# Altium schematic sheet obc-v2_OUT-eMMC.SchDoc
size 420 x 297 mm; SheetNumber: 5; SheetTotal: 23
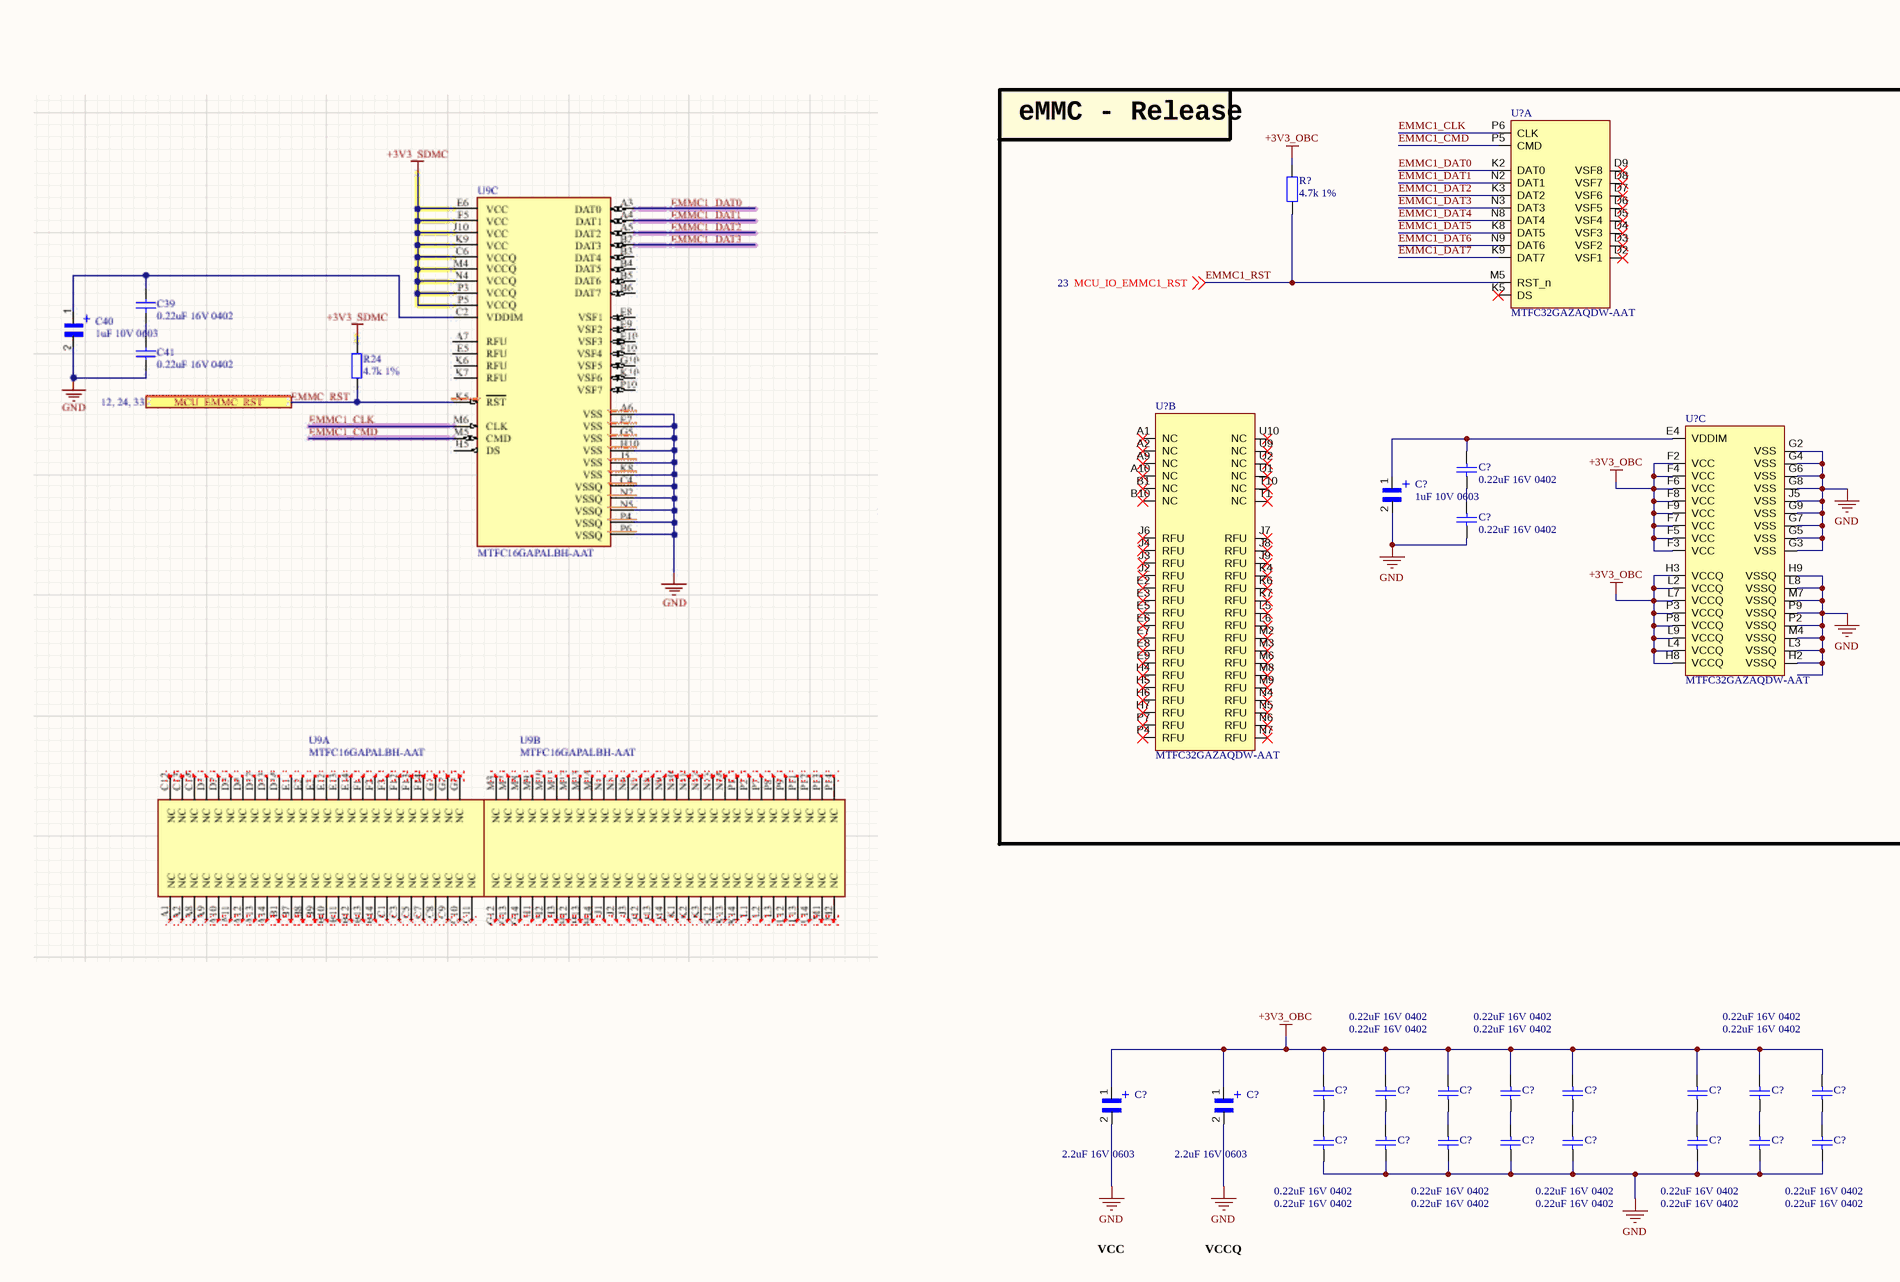
[diagram p0: obc-v2_OUT-eMMC.SchDoc, left]
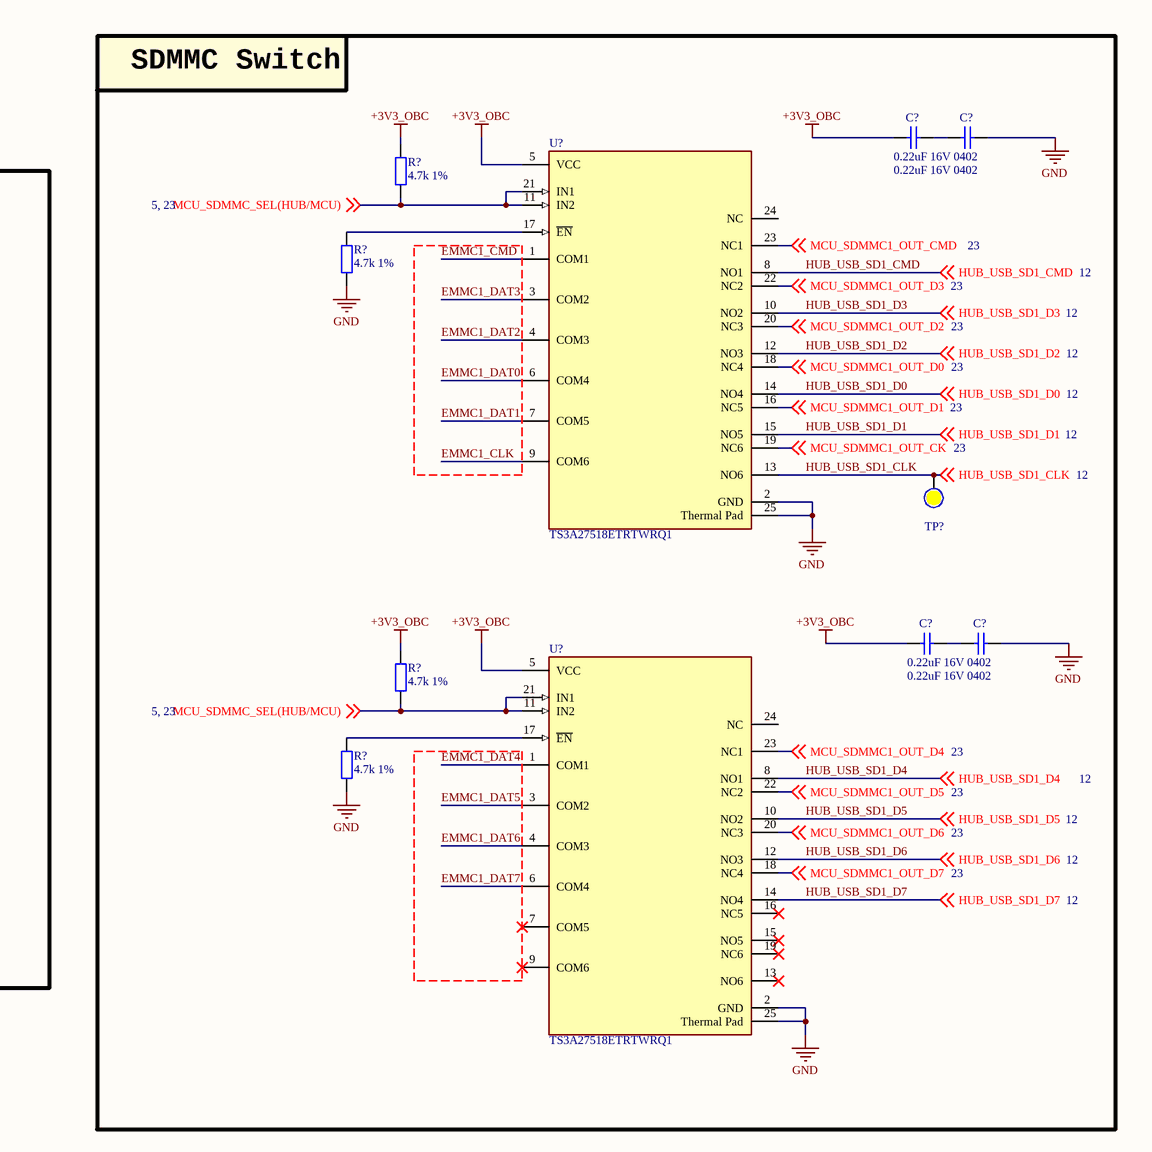
[diagram p1: obc-v2_OUT-eMMC.SchDoc, right]

## Parts
(Parts that share a designator on the sheet are numbered #1, #2 ... from top to bottom, then left to right.)
C?#1  0.22uF 16V 0402  [tu 0402]
C?#2  0.22uF 16V 0402  [tu 0402]
C?#3  0.22uF 16V 0402  [tu 0402]
C?#4  1uF 10V 0603  [CAPC1608X90]
C?#5  0.22uF 16V 0402  [tu 0402]
C?#6  0.22uF 16V 0402  [tu 0402]
C?#7  0.22uF 16V 0402  [tu 0402]
C?#8  0.22uF 16V 0402  [tu 0402]
C?#9  0.22uF 16V 0402  [tu 0402]
C?#10  0.22uF 16V 0402  [tu 0402]
C?#11  0.22uF 16V 0402  [tu 0402]
C?#12  0.22uF 16V 0402  [tu 0402]
C?#13  0.22uF 16V 0402  [tu 0402]
C?#14  0.22uF 16V 0402  [tu 0402]
C?#15  0.22uF 16V 0402  [tu 0402]
C?#16  2.2uF 16V 0603  [CAPC1608X90]
C?#17  2.2uF 16V 0603  [CAPC1608X90]
C?#18  0.22uF 16V 0402  [tu 0402]
C?#19  0.22uF 16V 0402  [tu 0402]
C?#20  0.22uF 16V 0402  [tu 0402]
C?#21  0.22uF 16V 0402  [tu 0402]
C?#22  0.22uF 16V 0402  [tu 0402]
C?#23  0.22uF 16V 0402  [tu 0402]
C?#24  0.22uF 16V 0402  [tu 0402]
C?#25  0.22uF 16V 0402  [tu 0402]
R?#1  4.7k 1%  [tro smd 0603]
R?#2  4.7k 1%  [tro smd 0603]
R?#3  4.7k 1%  [tro smd 0603]
R?#4  4.7k 1%  [tro smd 0603]
R?#5  4.7k 1%  [tro smd 0603]
TP?  (no value)  [Test Point 1 Side]  (no BOM)
U?#1  TS3A27518ETRTWRQ1  [FP-RTW0024B-IPC_A]
U?#2  MTFC32GAZAQDW-AAT  (part A of 3)
U?#3  MTFC32GAZAQDW-AAT  (part C of 3)
U?#4  TS3A27518ETRTWRQ1  [FP-RTW0024B-IPC_A]
U?#5  MTFC32GAZAQDW-AAT  (part B of 3)

## Blocks framed on the sheet
SDMMC Switch: C?#1 C?#2 C?#6 C?#7 R?#1 R?#2 R?#4 R?#5 TP? U?#1 U?#4
eMMC - Release: C?#3-C?#5 R?#3 U?#2 U?#3 U?#5

## Nets
+3V3_OBC: C?#1.2 C?#6.2 C?#8.1 C?#9.1 C?#10.1 C?#11.1 C?#12.1 C?#13.1 C?#14.1 C?#15.1 C?#16.1 C?#17.1 R?#1.1 R?#3.1 R?#4.1 U?#1.5(VCC) U?#3.F2(VCC) U?#3.F3(VCC) U?#3.F4(VCC) U?#3.F5(VCC) U?#3.F6(VCC) U?#3.F7(VCC) U?#3.F8(VCC) U?#3.F9(VCC) U?#3.H3(VCCQ) U?#3.H8(VCCQ) U?#3.L2(VCCQ) U?#3.L4(VCCQ) U?#3.L7(VCCQ) U?#3.L9(VCCQ) U?#3.P3(VCCQ) U?#3.P8(VCCQ) U?#4.5(VCC)
GND: C?#2.1 C?#4.2 C?#5.2 C?#7.1 C?#16.2 C?#17.2 C?#18.2 C?#19.2 C?#20.2 C?#21.2 C?#22.2 C?#23.2 C?#24.2 C?#25.2 R?#2.2 R?#5.2 U?#1.2(GND) U?#1.25(Thermal_Pad) U?#3.G2(VSS) U?#3.G3(VSS) U?#3.G4(VSS) U?#3.G5(VSS) U?#3.G6(VSS) U?#3.G7(VSS) U?#3.G8(VSS) U?#3.G9(VSS) U?#3.H2(VSSQ) U?#3.H9(VSSQ) U?#3.J5(VSS) U?#3.L3(VSSQ) U?#3.L8(VSSQ) U?#3.M4(VSSQ) U?#3.M7(VSSQ) U?#3.P2(VSSQ) U?#3.P9(VSSQ) U?#4.2(GND) U?#4.25(Thermal_Pad)
EMMC1_CLK: U?#1.9(COM6) U?#2.P6(CLK)
EMMC1_CMD: U?#1.1(COM1) U?#2.P5(CMD)
EMMC1_DAT0: U?#1.6(COM4) U?#2.K2(DAT0)
EMMC1_DAT1: U?#1.7(COM5) U?#2.N2(DAT1)
EMMC1_DAT2: U?#1.4(COM3) U?#2.K3(DAT2)
EMMC1_DAT3: U?#1.3(COM2) U?#2.N3(DAT3)
EMMC1_DAT4: U?#2.N8(DAT4) U?#4.1(COM1)
EMMC1_DAT5: U?#2.K8(DAT5) U?#4.3(COM2)
EMMC1_DAT6: U?#2.N9(DAT6) U?#4.4(COM3)
EMMC1_DAT7: U?#2.K9(DAT7) U?#4.6(COM4)
EMMC1_RST: R?#3.2 U?#2.M5(RST_n) ; off-sheet MCU_IO_EMMC1_RST  [also labelled MCU_IO_EMMC1_RST]
HUB_USB_SD1_CLK: TP?.0 U?#1.13(NO6) ; off-sheet HUB_USB_SD1_CLK
HUB_USB_SD1_CMD: U?#1.8(NO1) ; off-sheet HUB_USB_SD1_CMD
HUB_USB_SD1_D0: U?#1.14(NO4) ; off-sheet HUB_USB_SD1_D0
HUB_USB_SD1_D1: U?#1.15(NO5) ; off-sheet HUB_USB_SD1_D1
HUB_USB_SD1_D2: U?#1.12(NO3) ; off-sheet HUB_USB_SD1_D2
HUB_USB_SD1_D3: U?#1.10(NO2) ; off-sheet HUB_USB_SD1_D3
HUB_USB_SD1_D4: U?#4.8(NO1) ; off-sheet HUB_USB_SD1_D4
HUB_USB_SD1_D5: U?#4.10(NO2) ; off-sheet HUB_USB_SD1_D5
HUB_USB_SD1_D6: U?#4.12(NO3) ; off-sheet HUB_USB_SD1_D6
HUB_USB_SD1_D7: U?#4.14(NO4) ; off-sheet HUB_USB_SD1_D7
MCU_SDMMC1_OUT_CK: U?#1.19(NC6) ; off-sheet MCU_SDMMC1_OUT_CK
MCU_SDMMC1_OUT_CMD: U?#1.23(NC1) ; off-sheet MCU_SDMMC1_OUT_CMD
MCU_SDMMC1_OUT_D0: U?#1.18(NC4) ; off-sheet MCU_SDMMC1_OUT_D0
MCU_SDMMC1_OUT_D1: U?#1.16(NC5) ; off-sheet MCU_SDMMC1_OUT_D1
MCU_SDMMC1_OUT_D2: U?#1.20(NC3) ; off-sheet MCU_SDMMC1_OUT_D2
MCU_SDMMC1_OUT_D3: U?#1.22(NC2) ; off-sheet MCU_SDMMC1_OUT_D3
MCU_SDMMC1_OUT_D4: U?#4.23(NC1) ; off-sheet MCU_SDMMC1_OUT_D4
MCU_SDMMC1_OUT_D5: U?#4.22(NC2) ; off-sheet MCU_SDMMC1_OUT_D5
MCU_SDMMC1_OUT_D6: U?#4.20(NC3) ; off-sheet MCU_SDMMC1_OUT_D6
MCU_SDMMC1_OUT_D7: U?#4.18(NC4) ; off-sheet MCU_SDMMC1_OUT_D7
MCU_SDMMC_SEL(HUB/MCU): R?#1.2 R?#4.2 U?#1.11(IN2) U?#1.21(IN1) U?#4.11(IN2) U?#4.21(IN1) ; off-sheet MCU_SDMMC_SEL(HUB/MCU)
NetC?#1_1: C?#1.1 C?#2.2
NetC?#3_1: C?#3.1 C?#4.1 U?#3.E4(VDDIM)
NetC?#3_2: C?#3.2 C?#5.1
NetC?#6_1: C?#6.1 C?#7.2
NetC?#8_2: C?#8.2 C?#18.1
NetC?#9_2: C?#9.2 C?#19.1
NetC?#10_2: C?#10.2 C?#20.1
NetC?#11_2: C?#11.2 C?#21.1
NetC?#12_2: C?#12.2 C?#22.1
NetC?#13_2: C?#13.2 C?#23.1
NetC?#14_2: C?#14.2 C?#24.1
NetC?#15_2: C?#15.2 C?#25.1
NetR?#2_1: R?#2.1 U?#1.17(~{EN})
NetR?#5_1: R?#5.1 U?#4.17(~{EN})

Not connected (* = marked no-connect by the designer): U?#1 24(NC); U?#2 D2(VSF1)* D3(VSF2)* D4(VSF3)* D5(VSF4)* D6(VSF5)* D7(VSF6)* D8(VSF7)* D9(VSF8)* K5(DS)*; U?#4 7(COM5)* 9(COM6)* 13(NO6)* 15(NO5)* 16(NC5)* 19(NC6)* 24(NC); U?#5 A1(NC)* A2(NC)* A9(NC)* A10(NC)* B1(NC)* B10(NC)* E2(RFU)* E3(RFU)* E5(RFU)* E6(RFU)* E7(RFU)* E8(RFU)* E9(RFU)* H4(RFU)* H5(RFU)* H6(RFU)* H7(RFU)* J2(RFU)* J3(RFU)* J4(RFU)* J6(RFU)* J7(RFU)* J8(RFU)* J9(RFU)* K4(RFU)* K6(RFU)* K7(RFU)* L5(RFU)* L6(RFU)* M2(RFU)* M3(RFU)* M6(RFU)* M8(RFU)* M9(RFU)* N4(RFU)* N5(RFU)* N6(RFU)* N7(RFU)* P4(RFU)* P7(RFU)* T1(NC)* T10(NC)* U1(NC)* U2(NC)* U9(NC)* U10(NC)*

## Notes on the sheet
- VCC
- VCCQ
- Project:
- Sub-system:
- Design by:
- Sheet title:
- Sheet
- A3
- of
- Checked by:
- Approved by:
- Revision:
- Document No:
- Size:
- Date:
- (in symbol TACL335M003RTA) +

## Library data of the parts
C?#1-C?#3 C?#5-C?#15 C?#18-C?#25 = Tu 0402 33nF 10V: 0.22 µF ±10% 16V Ceramic Capacitor X7R 0402 (1005 Metric): GCM155R71C224KE02D; Chung_Loai: Dán; Don_Vi: Con; So_Chan: 2; Ten_Linh_Kien: Tụ 0402 33nF X7R 10V GRM155R71A333KA01D; Ma_Hang: MH007853; Kieu_Chan: *
C?#4 = TACL335M003RTA: 1 µF Molded Tantalum Capacitors 10 V 0603 (1608 Metric) 12Ohm @ 100kHz: TP8M105M010C; Package: None; Price: None; Value: *; MP: TACL335M003RTA; Availability: Unavailable
C?#16 C?#17 = TACL335M003RTA: 2.2 µF Molded Tantalum Capacitors 16 V 0603 (1608 Metric) 12Ohm @ 100kHz: TP8M225M016C; Package: None; Price: None; Value: *; MP: TACL335M003RTA; Availability: Unavailable
R?#1-R?#5 = Tro 0603 1% 10k: RES 4.7K OHM 1% 1/10W 0603, P/N: ERJ-U03F4701V; Chung_Loai: Dán; Don_Vi: Con; So_Chan: 2; Ten_Linh_Kien: Trở 0603 1% 10k; Ma_Hang: MH006333; Kieu_Chan: *
TP? = Test Point: Solder: NF
U?#1 U?#4 = CMP-04892-000110-1: IC MUX/DEMUX 1X2 24WQFN; Supply Type: Single; Max Supply Voltage: 3.6V; Number of Circuits: 6; On-State Resistance: 6.2R; Turn-Off Delay Time: 70ns; -3db Bandwidth: 240MHz; Operating Supply Current: 40nA; Min Supply Voltage: 1.65V; Logic Function: Multiplexer; Turn-On Delay Time: 68ns; Min Operating Temperature: -40°C; Packaging: Tape and Reel; Case/Package: QFN; Package Quantity: 1; RoHS Compliant: Yes; Lead Free: Lead Free; Bandwidth: 240MHz; Max Operating Temperature: 105°C; Number of Channels: 6; Series: Automotive, AEC-Q100; Number of Pins: 24; Mount: Surface Mount